# Altium schematic sheet Encoder Fin - MCU.SchDoc
size A
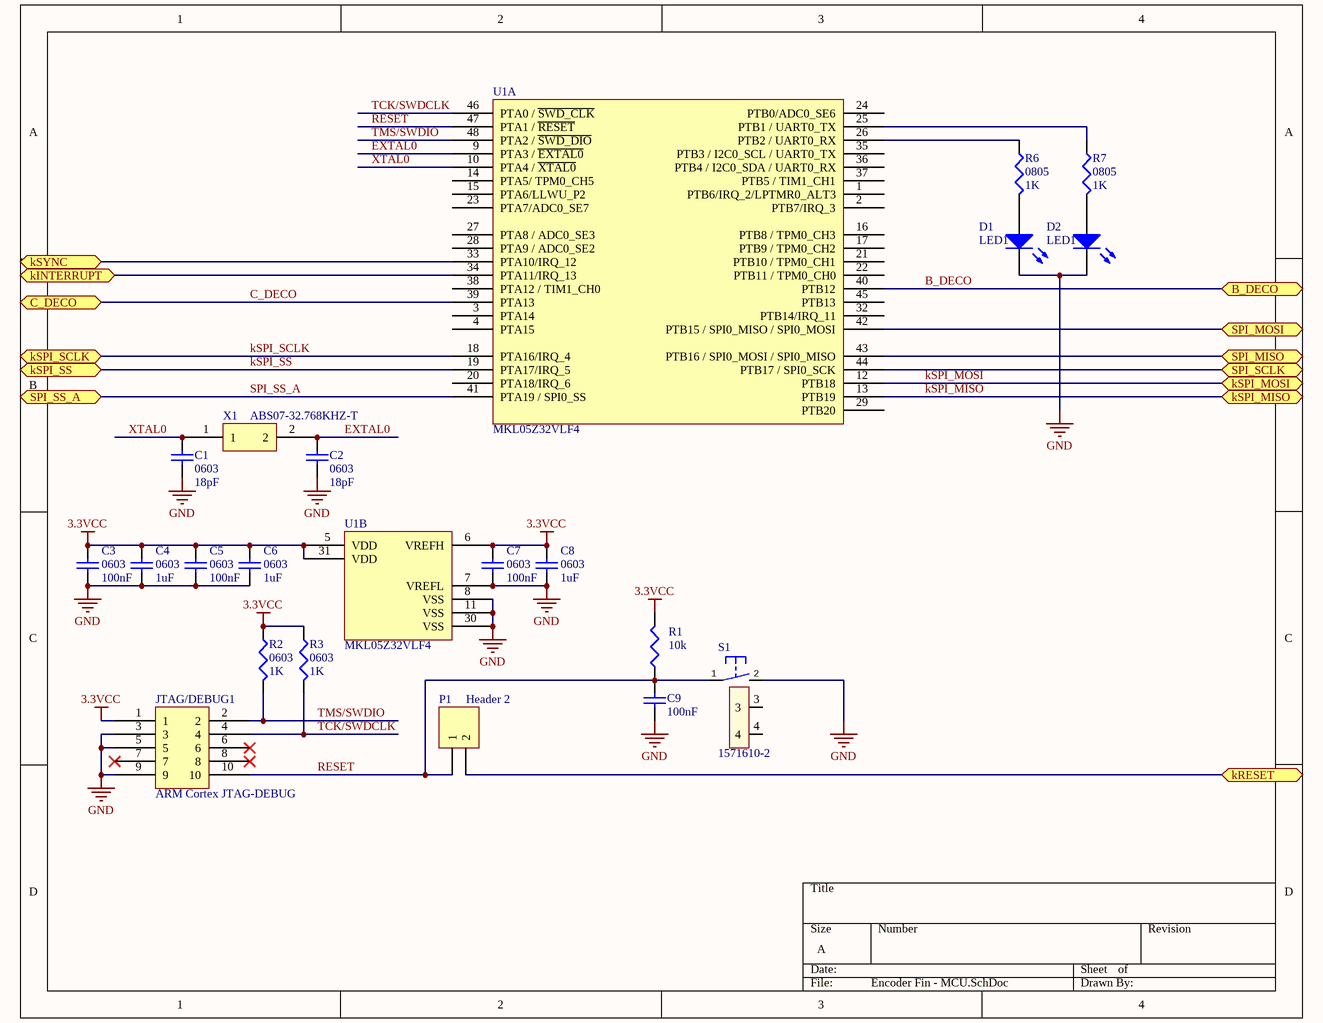
[diagram p0: Encoder Fin - MCU.SchDoc]

## Parts
C1  0603  value 18pF  [1608[0603]]
C2  0603  value 18pF  [1608[0603]]
C3  0603  value 100nF  [1608[0603]]
C4  0603  value 1uF  [1608[0603]]
C5  0603  value 100nF  [1608[0603]]
C6  0603  value 1uF  [1608[0603]]
C7  0603  value 100nF  [1608[0603]]
C8  0603  value 1uF  [1608[0603]]
C9  value 100nF  [1608[0603]]  (hidden comment: Cap Semi)
D1  LED1  [SM 0805 polarized]
D2  LED1  [SM 0805 polarized]
JTAG/DEBUG1  ARM Cortex JTAG-DEBUG  [FTSH-105-XX-X-DV]
P1  Header 2  [HDR1X2]
R1  value 10k  [J1-0603]  (hidden comment: Res3)
R2  0603  value 1K  [J1-0603]
R3  0603  value 1K  [J1-0603]
R6  0805  value 1K  [SM 0805 - gap trimmed]
R7  0805  value 1K  [SM 0805 - gap trimmed]
S1  1571610-2  [B3F-31XX]
U1  MKL05Z32VLF4  [MKL05Z32VLF4]  (parts A,B of 2)
X1  ABS07-32.768KHZ-T  [ABS07-32.768KHZ-T]

## Ports
B_DECO, C_DECO, kINTERRUPT, kRESET, kSPI_MISO, kSPI_MOSI, kSPI_SCLK, kSPI_SS, kSYNC, SPI_MISO, SPI_MOSI, SPI_SCLK, SPI_SS_A

## Nets
3.3VCC: C3.2 C4.2 C5.2 C6.2 C7.1 C8.1 JTAG/DEBUG1.1 R1.2 R2.1 R3.1 U1.5(VDD) U1.6(VREFH) U1.31(VDD)
GND: C1.2 C2.2 C3.1 C4.1 C5.1 C6.1 C7.2 C8.2 C9.1 D1.1(A) D2.1(A) JTAG/DEBUG1.3 JTAG/DEBUG1.5 JTAG/DEBUG1.9 S1.2(S) U1.7(VREFL) U1.8(VSS) U1.11(VSS) U1.30(VSS)
B_DECO: U1.40(PTB12) ; port B_DECO
C_DECO: U1.39(PTA13) ; port C_DECO
EXTAL0: C2.1 U1.9(PTA3_/_~{EXTAL0}) X1.2
kINTERRUPT: U1.34(PTA11/IRQ_13) ; port kINTERRUPT
kRESET: P1.2 ; port kRESET
kSPI_MISO: U1.13(PTB19) ; port kSPI_MISO
kSPI_MOSI: U1.12(PTB18) ; port kSPI_MOSI
kSPI_SCLK: U1.18(PTA16/IRQ_4) ; port kSPI_SCLK
kSPI_SS: U1.19(PTA17/IRQ_5) ; port kSPI_SS
kSYNC: U1.33(PTA10/IRQ_12) ; port kSYNC
RESET: C9.2 JTAG/DEBUG1.10 P1.1 R1.1 S1.1(P) U1.47(PTA1_/_~{RESET})
SPI_MISO: U1.43(PTB16_/_SPI0_MOSI_/_SPI0_MISO) ; port SPI_MISO
SPI_MOSI: U1.42(PTB15_/_SPI0_MISO_/_SPI0_MOSI) ; port SPI_MOSI
SPI_SCLK: U1.44(PTB17_/_SPI0_SCK) ; port SPI_SCLK
SPI_SS_A: U1.41(PTA19_/_SPI0_SS) ; port SPI_SS_A
TCK/SWDCLK: JTAG/DEBUG1.4 R3.2 U1.46(PTA0_/_~{SWD_CLK})
TMS/SWDIO: JTAG/DEBUG1.2 R2.2 U1.48(PTA2_/_~{SWD_DIO})
XTAL0: C1.1 U1.10(PTA4_/_~{XTAL0}) X1.1
NetD1_2: D1.2(K) R6.2
NetD2_2: D2.2(K) R7.2
NetR6_1: R6.1 U1.26(PTB2_/_UART0_RX)
NetR7_1: R7.1 U1.25(PTB1_/_UART0_TX)

Not connected (* = marked no-connect by the designer): JTAG/DEBUG1 6* 7* 8*; S1 3 4; U1 1(PTB6/IRQ_2/LPTMR0_ALT3) 2(PTB7/IRQ_3) 3(PTA14) 4(PTA15) 14(PTA5/_TPM0_CH5) 15(PTA6/LLWU_P2) 16(PTB8_/_TPM0_CH3) 17(PTB9_/_TPM0_CH2) 20(PTA18/IRQ_6) 21(PTB10_/_TPM0_CH1) 22(PTB11_/_TPM0_CH0) 23(PTA7/ADC0_SE7) 24(PTB0/ADC0_SE6) 27(PTA8_/_ADC0_SE3) 28(PTA9_/_ADC0_SE2) 29(PTB20) 32(PTB14/IRQ_11) 35(PTB3_/_I2C0_SCL_/_UART0_TX) 36(PTB4_/_I2C0_SDA_/_UART0_RX) 37(PTB5_/_TIM1_CH1) 38(PTA12_/_TIM1_CH0) 45(PTB13)

## Library data of the parts
C1-C9 = Cap Semi: Capacitor (Semiconductor SIM Model); Published: 8-Jun-2000; LatestRevisionDate: 29-May-2009; LatestRevisionNote: IPC-7351 Footprint Added.; PackageReference: C1206; Publisher: Altium Limited; PackageDescription: Chip Capacitor
D1 D2 = LED1: Typical RED GaAs LED; Published: 8-Jun-2000; LatestRevisionDate: 08-Jul-2005; LatestRevisionNote: Mech Layer 1 removed.; PackageReference: LED-1; Publisher: Altium Limited; PackageDescription: LED; 2 Leads
JTAG/DEBUG1 = ARM Cortex JTAG-DEBUG Header
P1 = Header 2: Header, 2-Pin; LatestRevisionDate: 17-Jul-2002; LatestRevisionNote: Re-released for DXP Platform.; Publisher: Altium Limited
R1-R3 R6 R7 = Res3: Resistor; Published: 8-Jun-2000; LatestRevisionDate: 29-May-2009; LatestRevisionNote: IPC-7351 Footprint Added.; PackageReference: J1-0603; Publisher: Altium Limited; PackageDescription: Chip Resistor
S1 = 1571610-2_1: SWTCH Momentary Washable; Manufacturer: Omron; Manufacturer: TE; LastRevisionNote: Import; ComponentLink1URL: http://www.te.com/commerce/DocumentDelivery/DDEController?Action=srchrtrv&DocNm=1571610&DocType=Customer+Drawing&DocLang=English; ComponentLink1Description: Datasheet for B3F-31XX; Published: 23-Apr-2014; Publisher: UltiMachine; LastRevisionDate: 23-Apr-2014; ManufacturerPartNumber: 1571610-2; Supplier 1: Mouser; Supplier Part Number 1: 506-1571610-2
U1 = MKL05Z32VLF4: ARM Cortex M0+
X1 = ABS07-32.768KHZ-T: ABS07-32.768KHZ-T RTC Crystal Oscillator